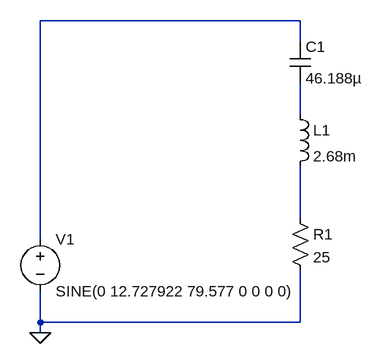
[diagram p0: schematic scheme6.asc]
scheme6.asc, the LTspice schematic file:
Version 4
SHEET 1 880 680
WIRE 544 -240 144 -240
WIRE 544 -208 544 -240
WIRE 544 -96 544 -144
WIRE 544 64 544 -16
WIRE 144 96 144 -240
WIRE 144 224 144 176
WIRE 544 224 544 144
WIRE 544 224 144 224
WIRE 144 240 144 224
FLAG 144 240 0
SYMBOL voltage 144 80 R0
WINDOW 123 0 0 Left 0
WINDOW 39 0 0 Left 0
SYMATTR InstName V1
SYMATTR Value SINE(0 12.727922 79.577 0 0 0 0)
SYMBOL res 528 48 R0
SYMATTR InstName R1
SYMATTR Value 25
SYMBOL ind 528 -112 R0
SYMATTR InstName L1
SYMATTR Value 2.68m
SYMBOL cap 528 -208 R0
SYMATTR InstName C1
SYMATTR Value 46.188µ

The netlist it stands for:
* scheme6.asc
V1 N001 0 SINE(0 12.727922 79.577 0 0 0 0)
R1 N003 0 25
L1 N002 N003 2.68m
C1 N001 N002 46.188µ
.backanno
.end